# Altium schematic sheet P01_Top Level.SchDoc
size C; SheetNumber: 1; SheetTotal: 7
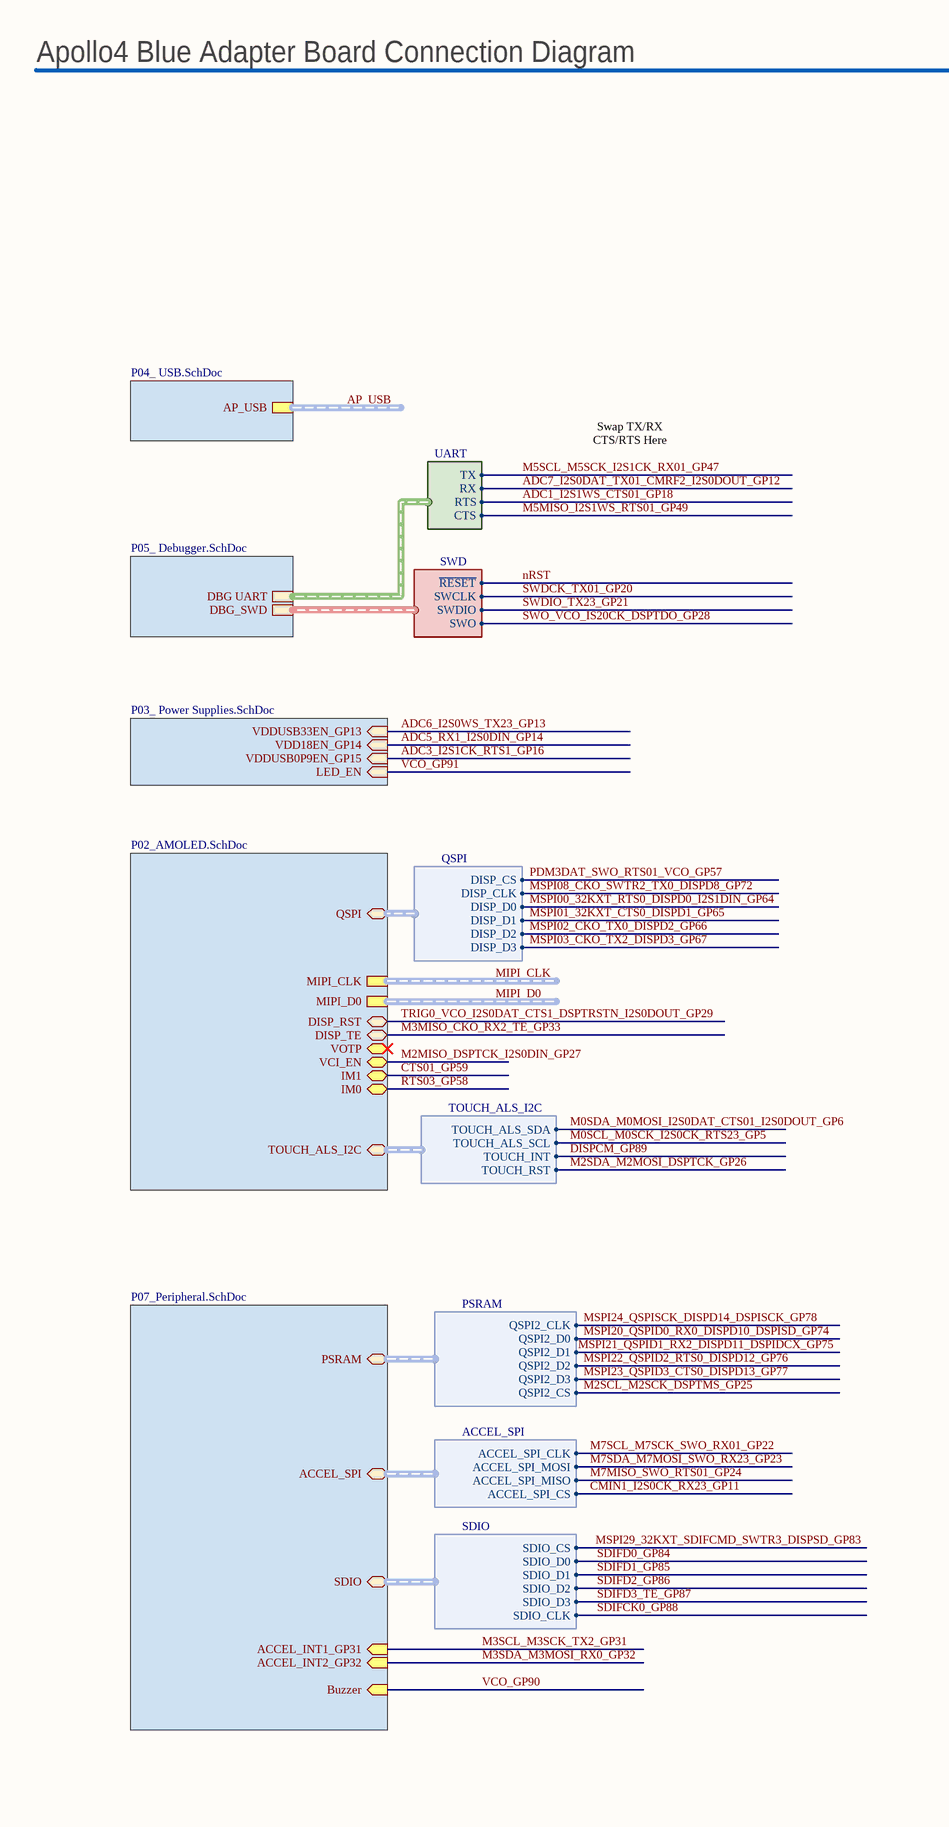
[diagram p0: P01_Top Level.SchDoc, left]
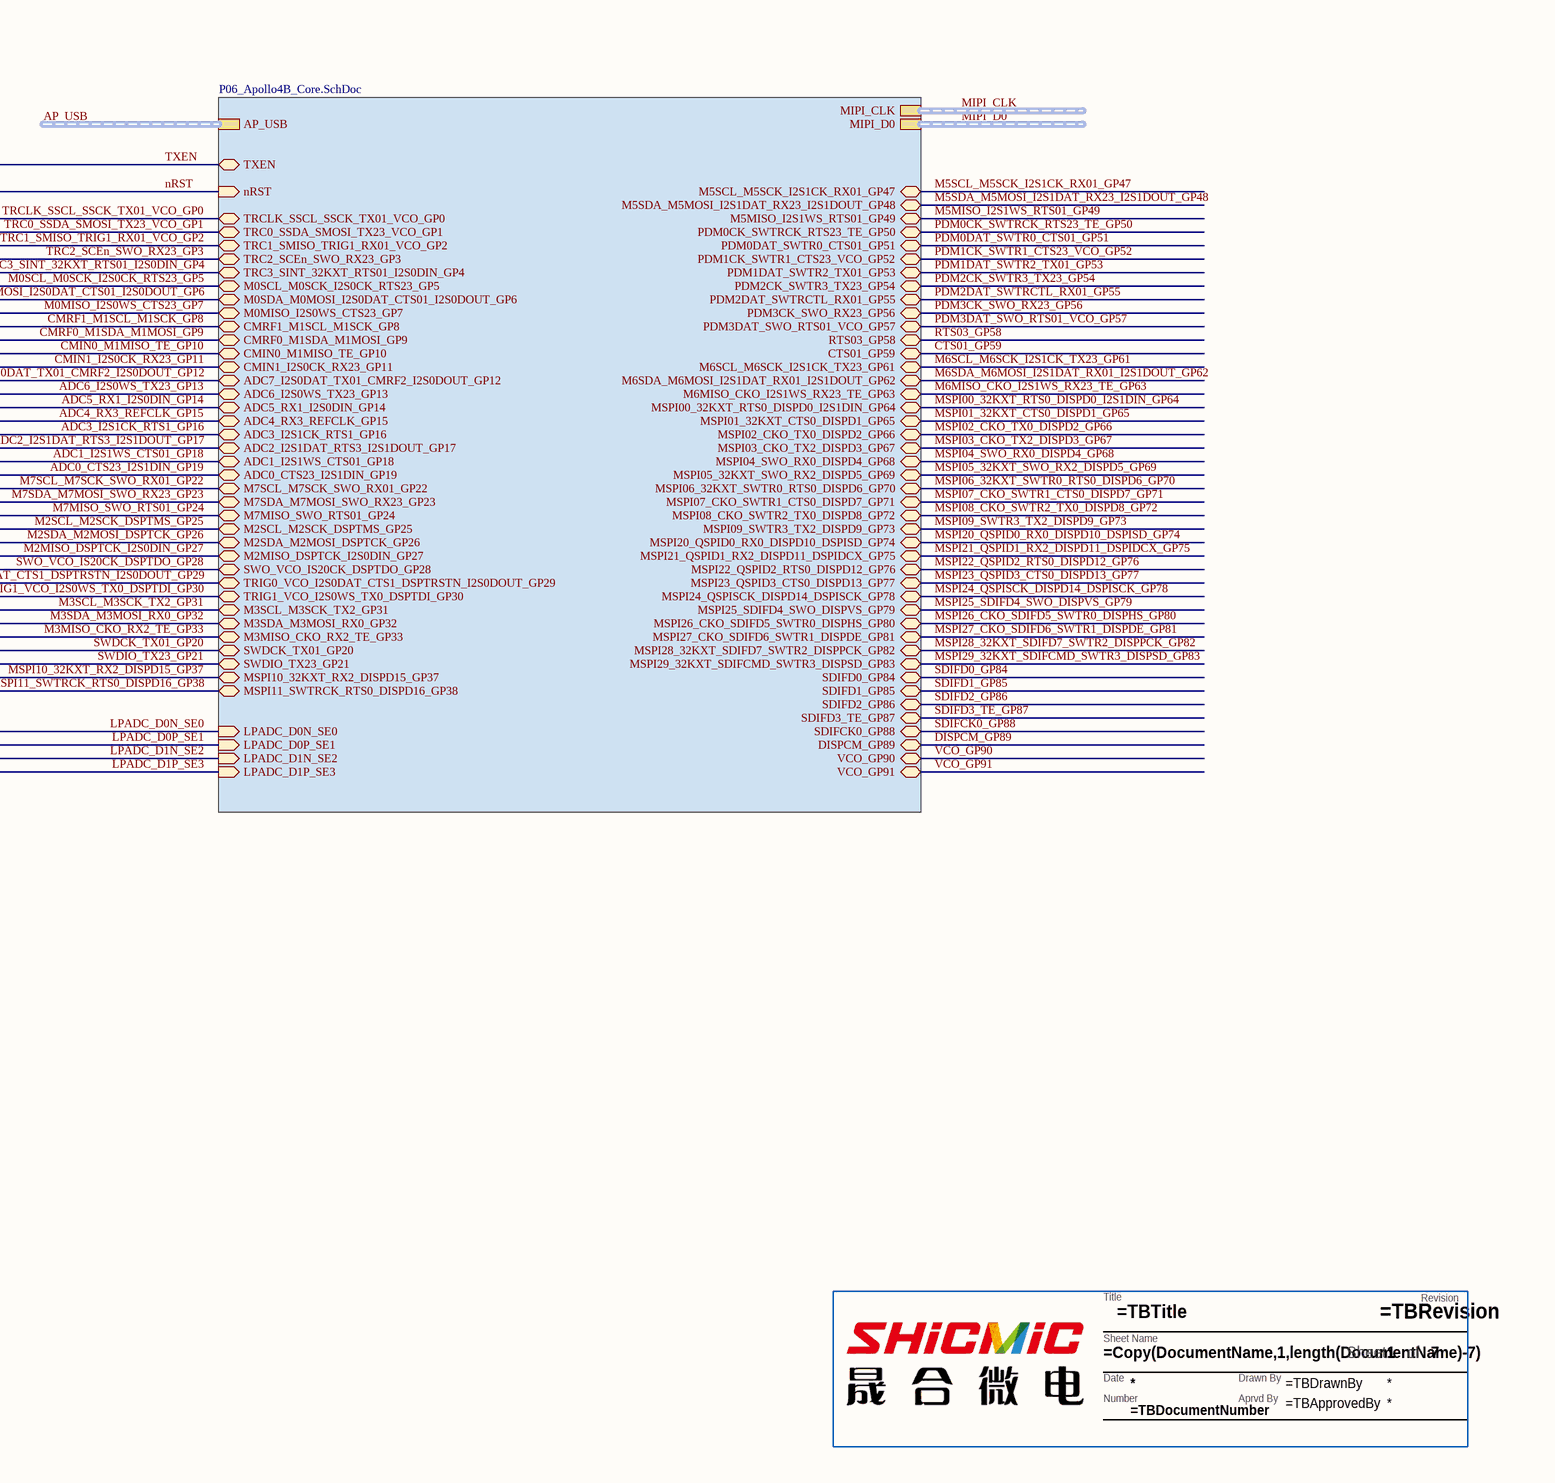
[diagram p1: P01_Top Level.SchDoc, right]

## Parts
?  TitleBlock  (value not drawn)  (graphical)

## Sub-sheets
P07_Peripheral = P07_Peripheral.SchDoc: PSRAM (bidir, harness PSRAM), ACCEL_SPI (bidir, harness ACCEL_SPI), SDIO (bidir, harness SDIO), Buzzer (in), ACCEL_INT1_GP31 (in), ACCEL_INT2_GP32 (in)
U_P02_ AMOLED = P02_AMOLED.SchDoc: QSPI (bidir, harness QSPI), MIPI_CLK (harness MIPI), MIPI_D0 (harness MIPI), DISP_TE (bidir), TOUCH_ALS_I2C (bidir, harness TOUCH_ALS_I2C), DISP_RST (bidir), VOTP (bidir), VCI_EN (bidir), IM1 (bidir), IM0 (bidir)
U_P03_ Power Supplies = P03_ Power Supplies.SchDoc: VDDUSB33EN_GP13 (in), VDD18EN_GP14 (in), LED_EN (in), VDDUSB0P9EN_GP15 (in)
U_P04_ USB = P04_ USB.SchDoc: AP_USB (harness USB)
U_P05_ Debugger = P05_ Debugger.SchDoc: DBG UART (harness UART), DBG_SWD (harness SWD)
U_P06_ Apollo4B_core = P06_Apollo4B_Core.SchDoc: MIPI_CLK (harness MIPI), MIPI_D0 (harness MIPI), TXEN (bidir), nRST (in), AP_USB (harness USB), LPADC_D0P_SE1 (in), LPADC_D0N_SE0 (in), LPADC_D1P_SE3 (in), LPADC_D1N_SE2 (in), TRCLK_SSCL_SSCK_TX01_VCO_GP0 (bidir), TRC0_SSDA_SMOSI_TX23_VCO_GP1 (bidir), TRC1_SMISO_TRIG1_RX01_VCO_GP2 (bidir), TRC2_SCEn_SWO_RX23_GP3 (bidir), M0SCL_M0SCK_I2S0CK_RTS23_GP5 (bidir), M0SDA_M0MOSI_I2S0DAT_CTS01_I2S0DOUT_GP6 (bidir), M0MISO_I2S0WS_CTS23_GP7 (bidir), CMRF1_M1SCL_M1SCK_GP8 (bidir), CMRF0_M1SDA_M1MOSI_GP9 (bidir), CMIN0_M1MISO_TE_GP10 (bidir), CMIN1_I2S0CK_RX23_GP11 (bidir), ADC7_I2S0DAT_TX01_CMRF2_I2S0DOUT_GP12 (bidir), ADC6_I2S0WS_TX23_GP13 (bidir), ADC5_RX1_I2S0DIN_GP14 (bidir), ADC4_RX3_REFCLK_GP15 (bidir), ADC3_I2S1CK_RTS1_GP16 (bidir), ADC2_I2S1DAT_RTS3_I2S1DOUT_GP17 (bidir), ADC1_I2S1WS_CTS01_GP18 (bidir), ADC0_CTS23_I2S1DIN_GP19 (bidir), M7SCL_M7SCK_SWO_RX01_GP22 (bidir), M7SDA_M7MOSI_SWO_RX23_GP23 (bidir), M7MISO_SWO_RTS01_GP24 (bidir), M2SCL_M2SCK_DSPTMS_GP25 (bidir), M2SDA_M2MOSI_DSPTCK_GP26 (bidir), M2MISO_DSPTCK_I2S0DIN_GP27 (bidir), SWO_VCO_IS20CK_DSPTDO_GP28 (bidir), TRIG0_VCO_I2S0DAT_CTS1_DSPTRSTN_I2S0DOUT_GP29 (bidir), TRIG1_VCO_I2S0WS_TX0_DSPTDI_GP30 (bidir), M3SCL_M3SCK_TX2_GP31 (bidir), M3SDA_M3MOSI_RX0_GP32 (bidir), M3MISO_CKO_RX2_TE_GP33 (bidir), SWDCK_TX01_GP20 (bidir), SWDIO_TX23_GP21 (bidir), MSPI10_32KXT_RX2_DISPD15_GP37 (bidir), MSPI11_SWTRCK_RTS0_DISPD16_GP38 (bidir), TRC3_SINT_32KXT_RTS01_I2S0DIN_GP4 (bidir), MSPI27_CKO_SDIFD6_SWTR1_DISPDE_GP81 (bidir), MSPI28_32KXT_SDIFD7_SWTR2_DISPPCK_GP82 (bidir), MSPI29_32KXT_SDIFCMD_SWTR3_DISPSD_GP83 (bidir), SDIFD0_GP84 (bidir), SDIFD1_GP85 (bidir), SDIFD2_GP86 (bidir), SDIFD3_TE_GP87 (bidir), SDIFCK0_GP88 (bidir), VCO_GP91 (bidir), MSPI00_32KXT_RTS0_DISPD0_I2S1DIN_GP64 (bidir), MSPI01_32KXT_CTS0_DISPD1_GP65 (bidir), MSPI02_CKO_TX0_DISPD2_GP66 (bidir), MSPI03_CKO_TX2_DISPD3_GP67 (bidir), MSPI04_SWO_RX0_DISPD4_GP68 (bidir), MSPI05_32KXT_SWO_RX2_DISPD5_GP69 (bidir), MSPI06_32KXT_SWTR0_RTS0_DISPD6_GP70 (bidir), MSPI07_CKO_SWTR1_CTS0_DISPD7_GP71 (bidir), MSPI08_CKO_SWTR2_TX0_DISPD8_GP72 (bidir), MSPI09_SWTR3_TX2_DISPD9_GP73 (bidir), MSPI20_QSPID0_RX0_DISPD10_DSPISD_GP74 (bidir), MSPI21_QSPID1_RX2_DISPD11_DSPIDCX_GP75 (bidir), MSPI22_QSPID2_RTS0_DISPD12_GP76 (bidir), MSPI23_QSPID3_CTS0_DISPD13_GP77 (bidir), MSPI24_QSPISCK_DISPD14_DSPISCK_GP78 (bidir), MSPI25_SDIFD4_SWO_DISPVS_GP79 (bidir), MSPI26_CKO_SDIFD5_SWTR0_DISPHS_GP80 (bidir), M5SCL_M5SCK_I2S1CK_RX01_GP47 (bidir), M5SDA_M5MOSI_I2S1DAT_RX23_I2S1DOUT_GP48 (bidir), M5MISO_I2S1WS_RTS01_GP49 (bidir), PDM0CK_SWTRCK_RTS23_TE_GP50 (bidir), PDM0DAT_SWTR0_CTS01_GP51 (bidir), PDM3CK_SWO_RX23_GP56 (bidir), PDM3DAT_SWO_RTS01_VCO_GP57 (bidir), M6SCL_M6SCK_I2S1CK_TX23_GP61 (bidir), M6SDA_M6MOSI_I2S1DAT_RX01_I2S1DOUT_GP62 (bidir), M6MISO_CKO_I2S1WS_RX23_TE_GP63 (bidir), RTS03_GP58 (bidir), CTS01_GP59 (bidir), PDM1DAT_SWTR2_TX01_GP53 (bidir), PDM1CK_SWTR1_CTS23_VCO_GP52 (bidir), PDM2DAT_SWTRCTL_RX01_GP55 (bidir), PDM2CK_SWTR3_TX23_GP54 (bidir), DISPCM_GP89 (bidir), VCO_GP90 (bidir)

## Harnesses
UART: TX, RX, RTS, CTS
SWD: SWCLK, SWDIO, SWO, ~{RESET}
QSPI: DISP_CLK, DISP_D0, DISP_D1, DISP_D2, DISP_D3, DISP_CS
TOUCH_ALS_I2C: TOUCH_ALS_SDA, TOUCH_ALS_SCL, TOUCH_INT, TOUCH_RST
ACCEL_SPI: ACCEL_SPI_CLK, ACCEL_SPI_MOSI, ACCEL_SPI_MISO, ACCEL_SPI_CS
PSRAM: QSPI2_CLK, QSPI2_D0, QSPI2_D1, QSPI2_D2, QSPI2_D3, QSPI2_CS
SDIO: SDIO_CLK, SDIO_CS, SDIO_D0, SDIO_D1, SDIO_D2, SDIO_D3

## Nets
ADC0_CTS23_I2S1DIN_GP19: sheet U_P06_ Apollo4B_core/ADC0_CTS23_I2S1DIN_GP19
ADC1_I2S1WS_CTS01_GP18: sheet U_P06_ Apollo4B_core/ADC1_I2S1WS_CTS01_GP18, sheet U_P05_ Debugger/DBG UART.RTS
ADC2_I2S1DAT_RTS3_I2S1DOUT_GP17: sheet U_P06_ Apollo4B_core/ADC2_I2S1DAT_RTS3_I2S1DOUT_GP17
ADC3_I2S1CK_RTS1_GP16: sheet U_P06_ Apollo4B_core/ADC3_I2S1CK_RTS1_GP16, sheet U_P03_ Power Supplies/VDDUSB0P9EN_GP15
ADC4_RX3_REFCLK_GP15: sheet U_P06_ Apollo4B_core/ADC4_RX3_REFCLK_GP15
ADC5_RX1_I2S0DIN_GP14: sheet U_P06_ Apollo4B_core/ADC5_RX1_I2S0DIN_GP14, sheet U_P03_ Power Supplies/VDD18EN_GP14
ADC6_I2S0WS_TX23_GP13: sheet U_P06_ Apollo4B_core/ADC6_I2S0WS_TX23_GP13, sheet U_P03_ Power Supplies/VDDUSB33EN_GP13
ADC7_I2S0DAT_TX01_CMRF2_I2S0DOUT_GP12: sheet U_P06_ Apollo4B_core/ADC7_I2S0DAT_TX01_CMRF2_I2S0DOUT_GP12, sheet U_P05_ Debugger/DBG UART.RX
CMIN0_M1MISO_TE_GP10: sheet U_P06_ Apollo4B_core/CMIN0_M1MISO_TE_GP10
CMIN1_I2S0CK_RX23_GP11: sheet U_P06_ Apollo4B_core/CMIN1_I2S0CK_RX23_GP11, sheet P07_Peripheral/ACCEL_SPI.ACCEL_SPI_CS
CMRF0_M1SDA_M1MOSI_GP9: sheet U_P06_ Apollo4B_core/CMRF0_M1SDA_M1MOSI_GP9
CMRF1_M1SCL_M1SCK_GP8: sheet U_P06_ Apollo4B_core/CMRF1_M1SCL_M1SCK_GP8
CTS01_GP59: sheet U_P06_ Apollo4B_core/CTS01_GP59, sheet U_P02_ AMOLED/IM1
DISPCM_GP89: sheet U_P06_ Apollo4B_core/DISPCM_GP89, sheet U_P02_ AMOLED/TOUCH_ALS_I2C.TOUCH_INT
LPADC_D0N_SE0: sheet U_P06_ Apollo4B_core/LPADC_D0N_SE0
LPADC_D0P_SE1: sheet U_P06_ Apollo4B_core/LPADC_D0P_SE1
LPADC_D1N_SE2: sheet U_P06_ Apollo4B_core/LPADC_D1N_SE2
LPADC_D1P_SE3: sheet U_P06_ Apollo4B_core/LPADC_D1P_SE3
M0MISO_I2S0WS_CTS23_GP7: sheet U_P06_ Apollo4B_core/M0MISO_I2S0WS_CTS23_GP7
M0SCL_M0SCK_I2S0CK_RTS23_GP5: sheet U_P06_ Apollo4B_core/M0SCL_M0SCK_I2S0CK_RTS23_GP5, sheet U_P02_ AMOLED/TOUCH_ALS_I2C.TOUCH_ALS_SCL
M0SDA_M0MOSI_I2S0DAT_CTS01_I2S0DOUT_GP6: sheet U_P06_ Apollo4B_core/M0SDA_M0MOSI_I2S0DAT_CTS01_I2S0DOUT_GP6, sheet U_P02_ AMOLED/TOUCH_ALS_I2C.TOUCH_ALS_SDA
M2MISO_DSPTCK_I2S0DIN_GP27: sheet U_P06_ Apollo4B_core/M2MISO_DSPTCK_I2S0DIN_GP27, sheet U_P02_ AMOLED/VCI_EN
M2SCL_M2SCK_DSPTMS_GP25: sheet U_P06_ Apollo4B_core/M2SCL_M2SCK_DSPTMS_GP25, sheet P07_Peripheral/PSRAM.QSPI2_CS
M2SDA_M2MOSI_DSPTCK_GP26: sheet U_P06_ Apollo4B_core/M2SDA_M2MOSI_DSPTCK_GP26, sheet U_P02_ AMOLED/TOUCH_ALS_I2C.TOUCH_RST
M3MISO_CKO_RX2_TE_GP33: sheet U_P06_ Apollo4B_core/M3MISO_CKO_RX2_TE_GP33, sheet U_P02_ AMOLED/DISP_TE
M3SCL_M3SCK_TX2_GP31: sheet U_P06_ Apollo4B_core/M3SCL_M3SCK_TX2_GP31, sheet P07_Peripheral/ACCEL_INT1_GP31
M3SDA_M3MOSI_RX0_GP32: sheet U_P06_ Apollo4B_core/M3SDA_M3MOSI_RX0_GP32, sheet P07_Peripheral/ACCEL_INT2_GP32
M5MISO_I2S1WS_RTS01_GP49: sheet U_P06_ Apollo4B_core/M5MISO_I2S1WS_RTS01_GP49, sheet U_P05_ Debugger/DBG UART.CTS
M5SCL_M5SCK_I2S1CK_RX01_GP47: sheet U_P06_ Apollo4B_core/M5SCL_M5SCK_I2S1CK_RX01_GP47, sheet U_P05_ Debugger/DBG UART.TX
M5SDA_M5MOSI_I2S1DAT_RX23_I2S1DOUT_GP48: sheet U_P06_ Apollo4B_core/M5SDA_M5MOSI_I2S1DAT_RX23_I2S1DOUT_GP48
M6MISO_CKO_I2S1WS_RX23_TE_GP63: sheet U_P06_ Apollo4B_core/M6MISO_CKO_I2S1WS_RX23_TE_GP63
M6SCL_M6SCK_I2S1CK_TX23_GP61: sheet U_P06_ Apollo4B_core/M6SCL_M6SCK_I2S1CK_TX23_GP61
M6SDA_M6MOSI_I2S1DAT_RX01_I2S1DOUT_GP62: sheet U_P06_ Apollo4B_core/M6SDA_M6MOSI_I2S1DAT_RX01_I2S1DOUT_GP62
M7MISO_SWO_RTS01_GP24: sheet U_P06_ Apollo4B_core/M7MISO_SWO_RTS01_GP24, sheet P07_Peripheral/ACCEL_SPI.ACCEL_SPI_MISO
M7SCL_M7SCK_SWO_RX01_GP22: sheet U_P06_ Apollo4B_core/M7SCL_M7SCK_SWO_RX01_GP22, sheet P07_Peripheral/ACCEL_SPI.ACCEL_SPI_CLK
M7SDA_M7MOSI_SWO_RX23_GP23: sheet U_P06_ Apollo4B_core/M7SDA_M7MOSI_SWO_RX23_GP23, sheet P07_Peripheral/ACCEL_SPI.ACCEL_SPI_MOSI
MSPI00_32KXT_RTS0_DISPD0_I2S1DIN_GP64: sheet U_P06_ Apollo4B_core/MSPI00_32KXT_RTS0_DISPD0_I2S1DIN_GP64, sheet U_P02_ AMOLED/QSPI.DISP_D0
MSPI01_32KXT_CTS0_DISPD1_GP65: sheet U_P06_ Apollo4B_core/MSPI01_32KXT_CTS0_DISPD1_GP65, sheet U_P02_ AMOLED/QSPI.DISP_D1
MSPI02_CKO_TX0_DISPD2_GP66: sheet U_P06_ Apollo4B_core/MSPI02_CKO_TX0_DISPD2_GP66, sheet U_P02_ AMOLED/QSPI.DISP_D2
MSPI03_CKO_TX2_DISPD3_GP67: sheet U_P06_ Apollo4B_core/MSPI03_CKO_TX2_DISPD3_GP67, sheet U_P02_ AMOLED/QSPI.DISP_D3
MSPI04_SWO_RX0_DISPD4_GP68: sheet U_P06_ Apollo4B_core/MSPI04_SWO_RX0_DISPD4_GP68
MSPI05_32KXT_SWO_RX2_DISPD5_GP69: sheet U_P06_ Apollo4B_core/MSPI05_32KXT_SWO_RX2_DISPD5_GP69
MSPI06_32KXT_SWTR0_RTS0_DISPD6_GP70: sheet U_P06_ Apollo4B_core/MSPI06_32KXT_SWTR0_RTS0_DISPD6_GP70
MSPI07_CKO_SWTR1_CTS0_DISPD7_GP71: sheet U_P06_ Apollo4B_core/MSPI07_CKO_SWTR1_CTS0_DISPD7_GP71
MSPI08_CKO_SWTR2_TX0_DISPD8_GP72: sheet U_P06_ Apollo4B_core/MSPI08_CKO_SWTR2_TX0_DISPD8_GP72, sheet U_P02_ AMOLED/QSPI.DISP_CLK
MSPI09_SWTR3_TX2_DISPD9_GP73: sheet U_P06_ Apollo4B_core/MSPI09_SWTR3_TX2_DISPD9_GP73
MSPI10_32KXT_RX2_DISPD15_GP37: sheet U_P06_ Apollo4B_core/MSPI10_32KXT_RX2_DISPD15_GP37
MSPI11_SWTRCK_RTS0_DISPD16_GP38: sheet U_P06_ Apollo4B_core/MSPI11_SWTRCK_RTS0_DISPD16_GP38
MSPI20_QSPID0_RX0_DISPD10_DSPISD_GP74: sheet U_P06_ Apollo4B_core/MSPI20_QSPID0_RX0_DISPD10_DSPISD_GP74, sheet P07_Peripheral/PSRAM.QSPI2_D0
MSPI21_QSPID1_RX2_DISPD11_DSPIDCX_GP75: sheet U_P06_ Apollo4B_core/MSPI21_QSPID1_RX2_DISPD11_DSPIDCX_GP75, sheet P07_Peripheral/PSRAM.QSPI2_D1
MSPI22_QSPID2_RTS0_DISPD12_GP76: sheet U_P06_ Apollo4B_core/MSPI22_QSPID2_RTS0_DISPD12_GP76, sheet P07_Peripheral/PSRAM.QSPI2_D2
MSPI23_QSPID3_CTS0_DISPD13_GP77: sheet U_P06_ Apollo4B_core/MSPI23_QSPID3_CTS0_DISPD13_GP77, sheet P07_Peripheral/PSRAM.QSPI2_D3
MSPI24_QSPISCK_DISPD14_DSPISCK_GP78: sheet U_P06_ Apollo4B_core/MSPI24_QSPISCK_DISPD14_DSPISCK_GP78, sheet P07_Peripheral/PSRAM.QSPI2_CLK
MSPI25_SDIFD4_SWO_DISPVS_GP79: sheet U_P06_ Apollo4B_core/MSPI25_SDIFD4_SWO_DISPVS_GP79
MSPI26_CKO_SDIFD5_SWTR0_DISPHS_GP80: sheet U_P06_ Apollo4B_core/MSPI26_CKO_SDIFD5_SWTR0_DISPHS_GP80
MSPI27_CKO_SDIFD6_SWTR1_DISPDE_GP81: sheet U_P06_ Apollo4B_core/MSPI27_CKO_SDIFD6_SWTR1_DISPDE_GP81
MSPI28_32KXT_SDIFD7_SWTR2_DISPPCK_GP82: sheet U_P06_ Apollo4B_core/MSPI28_32KXT_SDIFD7_SWTR2_DISPPCK_GP82
MSPI29_32KXT_SDIFCMD_SWTR3_DISPSD_GP83: sheet U_P06_ Apollo4B_core/MSPI29_32KXT_SDIFCMD_SWTR3_DISPSD_GP83, sheet P07_Peripheral/SDIO.SDIO_CS
nRST: sheet U_P06_ Apollo4B_core/nRST, sheet U_P05_ Debugger/DBG_SWD.~{RESET}
PDM0CK_SWTRCK_RTS23_TE_GP50: sheet U_P06_ Apollo4B_core/PDM0CK_SWTRCK_RTS23_TE_GP50
PDM0DAT_SWTR0_CTS01_GP51: sheet U_P06_ Apollo4B_core/PDM0DAT_SWTR0_CTS01_GP51
PDM1CK_SWTR1_CTS23_VCO_GP52: sheet U_P06_ Apollo4B_core/PDM1CK_SWTR1_CTS23_VCO_GP52
PDM1DAT_SWTR2_TX01_GP53: sheet U_P06_ Apollo4B_core/PDM1DAT_SWTR2_TX01_GP53
PDM2CK_SWTR3_TX23_GP54: sheet U_P06_ Apollo4B_core/PDM2CK_SWTR3_TX23_GP54
PDM2DAT_SWTRCTL_RX01_GP55: sheet U_P06_ Apollo4B_core/PDM2DAT_SWTRCTL_RX01_GP55
PDM3CK_SWO_RX23_GP56: sheet U_P06_ Apollo4B_core/PDM3CK_SWO_RX23_GP56
PDM3DAT_SWO_RTS01_VCO_GP57: sheet U_P06_ Apollo4B_core/PDM3DAT_SWO_RTS01_VCO_GP57, sheet U_P02_ AMOLED/QSPI.DISP_CS
RTS03_GP58: sheet U_P06_ Apollo4B_core/RTS03_GP58, sheet U_P02_ AMOLED/IM0
SDIFCK0_GP88: sheet U_P06_ Apollo4B_core/SDIFCK0_GP88, sheet P07_Peripheral/SDIO.SDIO_CLK
SDIFD0_GP84: sheet U_P06_ Apollo4B_core/SDIFD0_GP84, sheet P07_Peripheral/SDIO.SDIO_D0
SDIFD1_GP85: sheet U_P06_ Apollo4B_core/SDIFD1_GP85, sheet P07_Peripheral/SDIO.SDIO_D1
SDIFD2_GP86: sheet U_P06_ Apollo4B_core/SDIFD2_GP86, sheet P07_Peripheral/SDIO.SDIO_D2
SDIFD3_TE_GP87: sheet U_P06_ Apollo4B_core/SDIFD3_TE_GP87, sheet P07_Peripheral/SDIO.SDIO_D3
SWDCK_TX01_GP20: sheet U_P06_ Apollo4B_core/SWDCK_TX01_GP20, sheet U_P05_ Debugger/DBG_SWD.SWCLK
SWDIO_TX23_GP21: sheet U_P06_ Apollo4B_core/SWDIO_TX23_GP21, sheet U_P05_ Debugger/DBG_SWD.SWDIO
SWO_VCO_IS20CK_DSPTDO_GP28: sheet U_P06_ Apollo4B_core/SWO_VCO_IS20CK_DSPTDO_GP28, sheet U_P05_ Debugger/DBG_SWD.SWO
TRC0_SSDA_SMOSI_TX23_VCO_GP1: sheet U_P06_ Apollo4B_core/TRC0_SSDA_SMOSI_TX23_VCO_GP1
TRC1_SMISO_TRIG1_RX01_VCO_GP2: sheet U_P06_ Apollo4B_core/TRC1_SMISO_TRIG1_RX01_VCO_GP2
TRC2_SCEn_SWO_RX23_GP3: sheet U_P06_ Apollo4B_core/TRC2_SCEn_SWO_RX23_GP3
TRC3_SINT_32KXT_RTS01_I2S0DIN_GP4: sheet U_P06_ Apollo4B_core/TRC3_SINT_32KXT_RTS01_I2S0DIN_GP4
TRCLK_SSCL_SSCK_TX01_VCO_GP0: sheet U_P06_ Apollo4B_core/TRCLK_SSCL_SSCK_TX01_VCO_GP0
TRIG0_VCO_I2S0DAT_CTS1_DSPTRSTN_I2S0DOUT_GP29: sheet U_P06_ Apollo4B_core/TRIG0_VCO_I2S0DAT_CTS1_DSPTRSTN_I2S0DOUT_GP29, sheet U_P02_ AMOLED/DISP_RST
TRIG1_VCO_I2S0WS_TX0_DSPTDI_GP30: sheet U_P06_ Apollo4B_core/TRIG1_VCO_I2S0WS_TX0_DSPTDI_GP30
TXEN: sheet U_P06_ Apollo4B_core/TXEN
VCO_GP90: sheet U_P06_ Apollo4B_core/VCO_GP90, sheet P07_Peripheral/Buzzer
VCO_GP91: sheet U_P06_ Apollo4B_core/VCO_GP91, sheet U_P03_ Power Supplies/LED_EN

## Buses and harness runs
harness AP_USB = sheet U_P04_ USB/AP_USB
harness AP_USB = sheet U_P06_ Apollo4B_core/AP_USB
harness MIPI_CLK = sheet U_P02_ AMOLED/MIPI_CLK
harness MIPI_CLK = sheet U_P06_ Apollo4B_core/MIPI_CLK
harness MIPI_D0 = sheet U_P02_ AMOLED/MIPI_D0
harness MIPI_D0 = sheet U_P06_ Apollo4B_core/MIPI_D0

## Notes on the sheet
- Apollo4 Blue Adapter Board Connection Diagram
- Swap TX/RX
- CTS/RTS Here
- (in symbol TitleBlock) Revision; Title; Sheet Name; Sheet; of; Date; Drawn By; Number; Aprvd By

## Library data of the parts
? = TitleBlock: Title block for Ambiq Schematics. Please have the following parameters entered in Project>Project Options>Parameters: / TBTitle / TBDocumentNumber / TBRevision / TBDrawnBy / TBApprovedBy; AMBIQ PN: TitleBlock